# Altium schematic sheet switch.SchDoc
size A; SheetNumber: 10; SheetTotal: 10
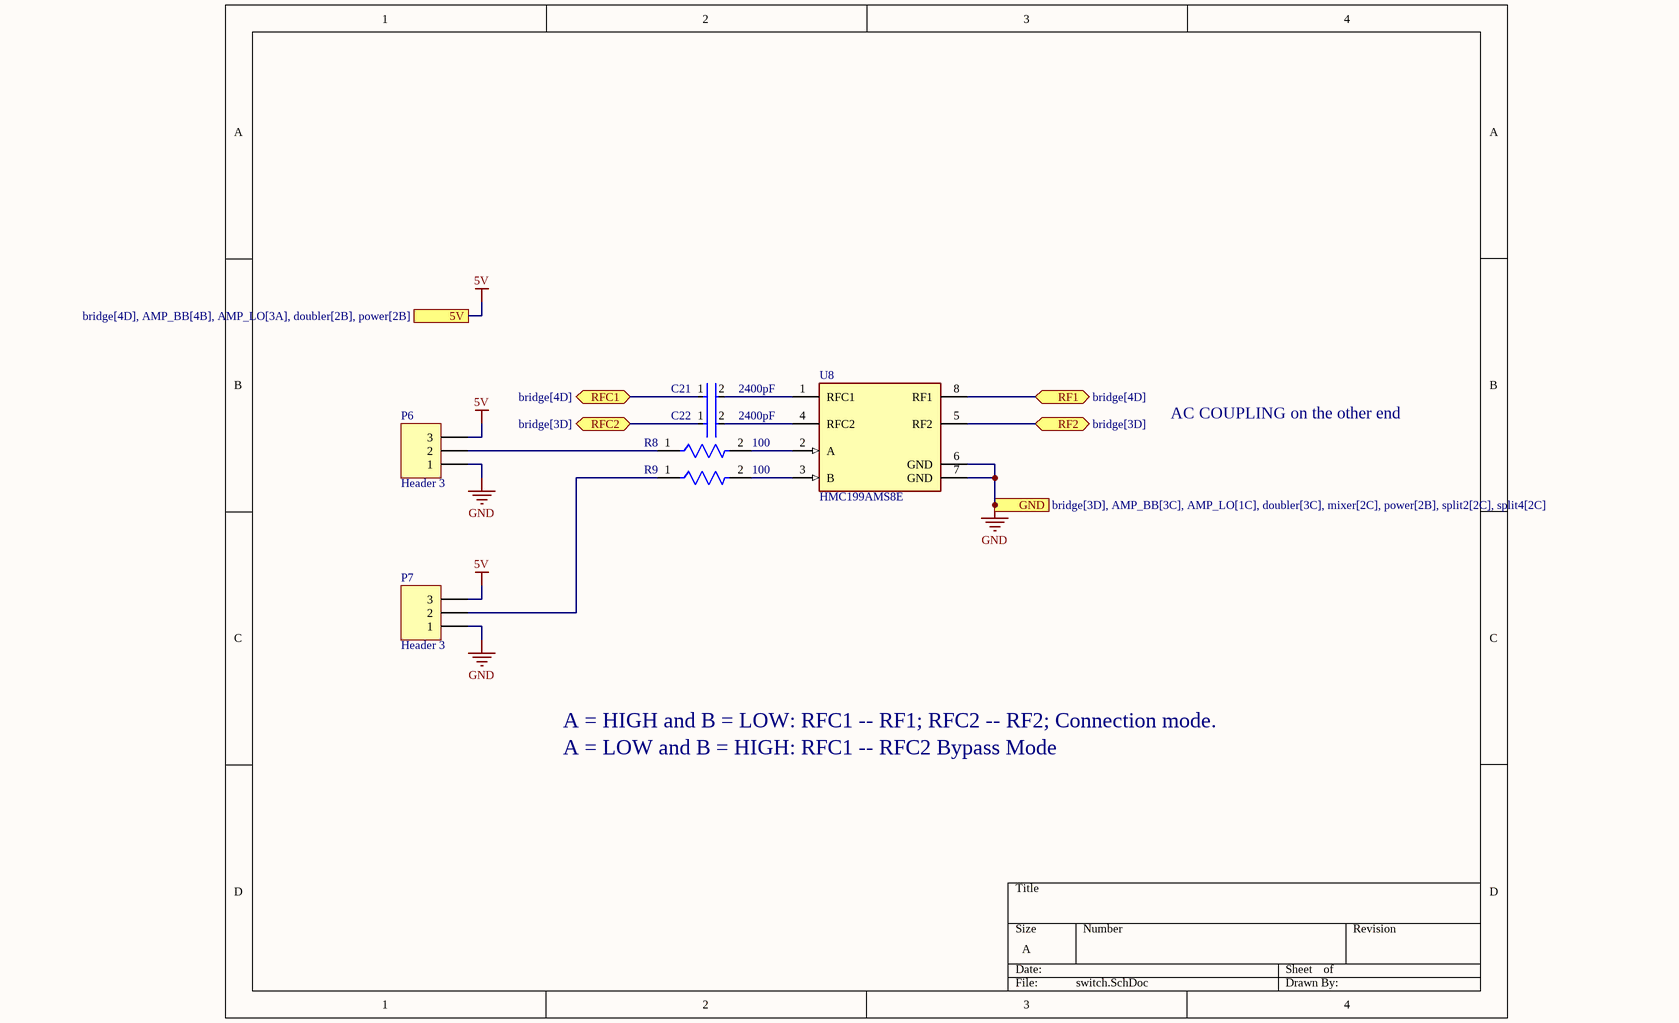
[diagram p0: switch.SchDoc]

## Parts
C21  2400pF  [FP-GRM188-0_1-e0_2_0_5-MFG]
C22  2400pF  [FP-GRM188-0_1-e0_2_0_5-MFG]
P6  Header 3  [HDR1X3]
P7  Header 3  [HDR1X3]
R8  100  [FP-RC0603-0_55-MFG]
R9  100  [FP-RC0603-0_55-MFG]
U8  HMC199AMS8E  [FP-RM-8-IPC_A]

## Ports
5V (see bridge[4D], AMP_BB[4B], AMP_LO[3A], doubler[2B], power[2B]), GND (see bridge[3D], AMP_BB[3C], AMP_LO[1C], doubler[3C], mixer[2C], power[2B], split2[2C], split4[2C]), RF1 (bidir, see bridge[4D]), RF2 (bidir, see bridge[3D]), RFC1 (bidir, see bridge[4D]), RFC2 (bidir, see bridge[3D])

## Nets
5V: P6.3 P7.3 ; port 5V
GND: P6.1 P7.1 U8.6(GND) U8.7(GND) ; port GND
RF1: U8.8(RF1) ; port RF1
RF2: U8.5(RF2) ; port RF2
RFC1: C21.1 ; port RFC1
RFC2: C22.1 ; port RFC2
NetC21_2: C21.2 U8.1(RFC1)
NetC22_2: C22.2 U8.4(RFC2)
NetP6_2: P6.2 R8.1
NetP7_2: P7.2 R9.1
NetR8_2: R8.2 U8.2(A)
NetR9_2: R9.2 U8.3(B)

## Notes on the sheet
- AC COUPLING on the other end
- A = LOW and B = HIGH: RFC1 -- RFC2 Bypass Mode
- A = HIGH and B = LOW: RFC1 -- RF1; RFC2 -- RF2; Connection mode.

## Library data of the parts
C21 C22 = CMP-2006-02639-2: GRM1885C1H242JA01D; Chip Multilayer Ceramic Capacitors for General Purpose, 0603, 2400pF, C0G, 30ppm/°C, 5%, 50V; Capacitance: 2.4nF; Max Operating Temperature: 125°C; Thickness: 0.035inch; Width: 0.031inch; Voltage Rating (DC): 50V; Voltage Rating: 50V; Length: 1.6mm; Dielectric: C0G; Radiation Hardening: No; Lead Free: Lead Free; Case/Package: 0603; Height: 0.8mm; Termination: SMD/SMT; Tolerance: 5%; Case Code (Imperial): 0603; Voltage: 50V; Depth: 0.8mm; Mount: Surface Mount; Case Code (Metric): 1608; Packaging: Tape and Reel; Package Quantity: 4000; Min Operating Temperature: -55°C
P6 P7 = CMP-003-000091-1: Header, 3-Pin; Signal Integrity: Connector; Design Item ID: Header 3; Pin Count: 3; Component Type: Standard; LatestRevisionDate: 17-Jul-2002; Publisher: Altium Limited; LatestRevisionNote: Re-released for DXP Platform.; Source: Miscellaneous Connectors.SchLib
R8 R9 = CMP-2000-05021-2: RES SMD 100 OHM 5% 1/10W 0603; Temperature Coefficient: 100ppm/°C; Voltage Rating (DC): 50V; Power Rating: 100mW; Resistance: 100R; Features: Moisture Resistant; Width: 0.8mm; RoHS Compliant: Yes; Series: RC; Case Code (Metric): 1608; Packaging: Tape and Reel; Construction: Rectangular; Contact Plating: Tin; Resistor Type: Thick Film; Case/Package: 0603; Military Standard: Not; Case Code (Imperial): 0603; Number of Pins: 2; Length: 1.6mm; Size Code: 0603; Voltage Rating: 50V; Min Operating Temperature: -55°C; Max Power Dissipation: 100mW; Tolerance: 5%; Lead Free: Lead Free; Termination: SMD/SMT; Resistance Tolerance: 5%; Depth: 0.8mm; Max Operating Temperature: 155°C; Number of Terminations: 2; Radiation Hardening: No
U8 = CMP-09142-000241-1: IC RF SWITCH SPDT 2.5GHZ 8MSOP; Insertion Loss: 0.6dB; Max Power Dissipation: 380mW; P1dB: 28dBm; Operating Supply Voltage: 5V; Impedance: 50R; IIP3: 55dBm; Throw Configuration: SPDT; Max Operating Temperature: 85°C; Case/Package: MSOP; Min Operating Temperature: -40°C; Packaging: Strip; Mount: Surface Mount; Max Frequency: 2.5GHz; Series: -; RoHS Compliant: Yes; Number of Pins: 8; Contact Plating: Tin; Lead Free: Contains Lead; Test Frequency: 2.5GHz